# EAGLE design conv (EAGLE 9.6.2)
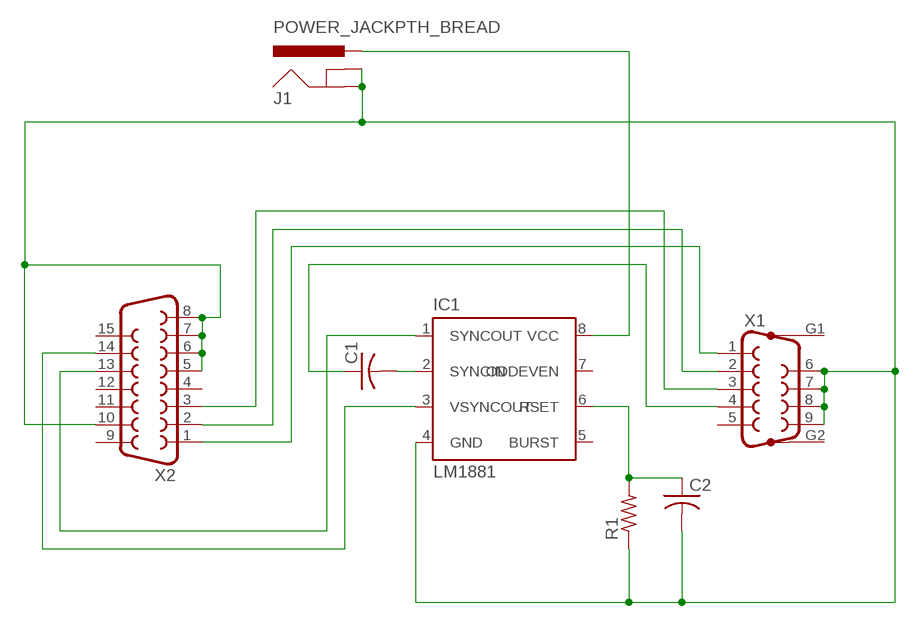
[diagram p0: schematic, sheet 1]

## Parts
C1  C-US025-040X050  [C025-040X050]
C2  C-US025-040X050  [C025-040X050]
IC1  LM1881  [DIL08]
J1  POWER_JACKPTH_BREAD  [POWER_JACK_PTH_BREAD]
R1  R-US_0207/10  [0207/10]
X1  F09HP  [F09HP]
X2  F15HDH  [HDF15H]

## Nets
GND: C2.2 IC1.4(GND) J1.GND J1.GNDBREAK R1.1 X1.6 X1.7 X1.8 X1.9 X2.5 X2.6 X2.7 X2.8 X2.10
N$1: X1.1 X2.1
N$2: X1.2 X2.2
N$3: X1.3 X2.3
N$4: C1.1 X1.4
N$5: C1.2 IC1.2(SYNCIN)
N$6: C2.1 IC1.6(RSET) R1.2
N$7: IC1.8(VCC) J1.PWR
N$8: IC1.1(SYNCOUT) X2.13
N$9: IC1.3(VSYNCOUT) X2.14
Unconnected: IC1.5(BURST) IC1.7(ODDEVEN) X1.5 X1.G1 X1.G2 X2.4 X2.9 X2.11 X2.12 X2.15

## Library data of the parts
C1 C2 = adafruit:C-US: CAPACITOR, American symbol
IC1 = lm1881:LM1881
J1 = SparkFun-Connectors:POWER_JACK: Power Jack Connector This is the standard 5.5mm barrel jack for power. The PTH is the most common, proven, reliable, footprint. The Slot footprint only works if the mill layer is transmitted to the PCB fab house so be warned. Here are the connectors we sell at SparkFun: DC Barrel Power Jack/Connector <https://www.sparkfun.com/products/119> (PRT-00119) DC Barrel Power Jack/Connector (SMD) <https://www.sparkfun.com/products/12748> (PRT-12748) DC Barrel Jack Adapter - Breadboard Compatible <https://www.sparkfun.com/products/10811> (PRT-10811) It is used on this SparkFun product (and many, many others): SparkFun RedBoard - Programmed with Arduino <https://www.sparkfun.com/products/12757> (DEV-12757) Also, if you need a mating power supply or connector, please check these out: Wall Adapter Power Supply - 9VDC 650mA <https://www.sparkfun.com/products/298> (TOL-00298) DC Barrel Jack Adapter - Male <https://www.sparkfun.com/products/10287> (PRT-10287); PROD_ID: PRT-10811
R1 = adafruit:R-US_: RESISTOR, American symbol
X1 = con-subd:F09HP: SUB-D; OC_FARNELL: unknown; OC_NEWARK: unknown
X2 = con-subd:F15: SUB-D; OC_FARNELL: unknown; OC_NEWARK: unknown

## Board
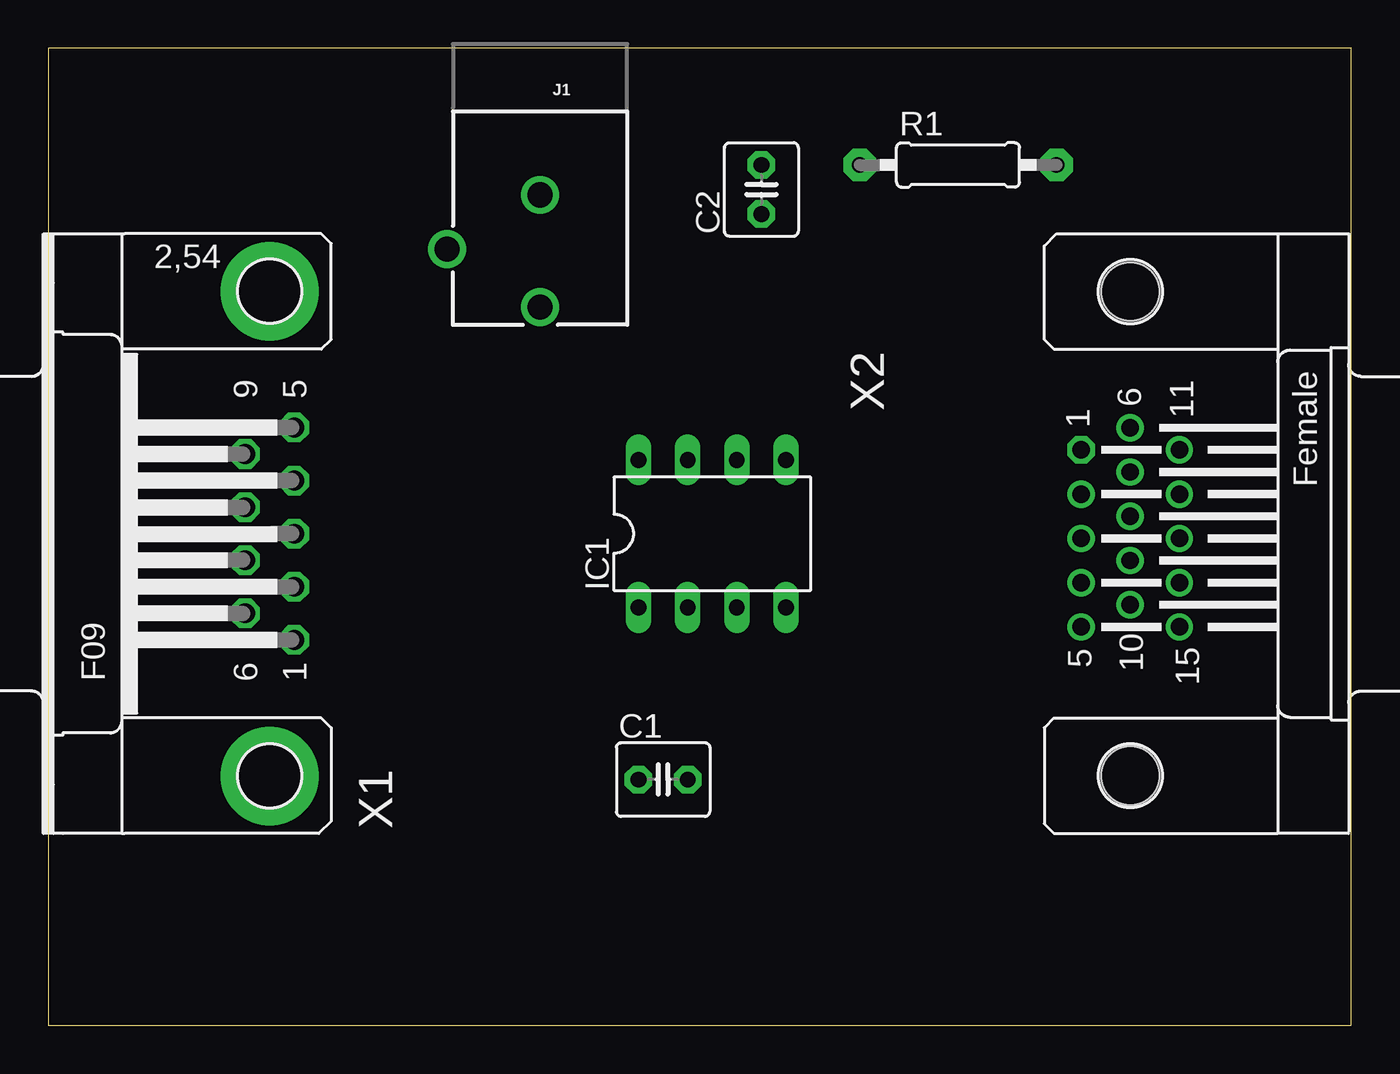
[diagram p1: board, top side]
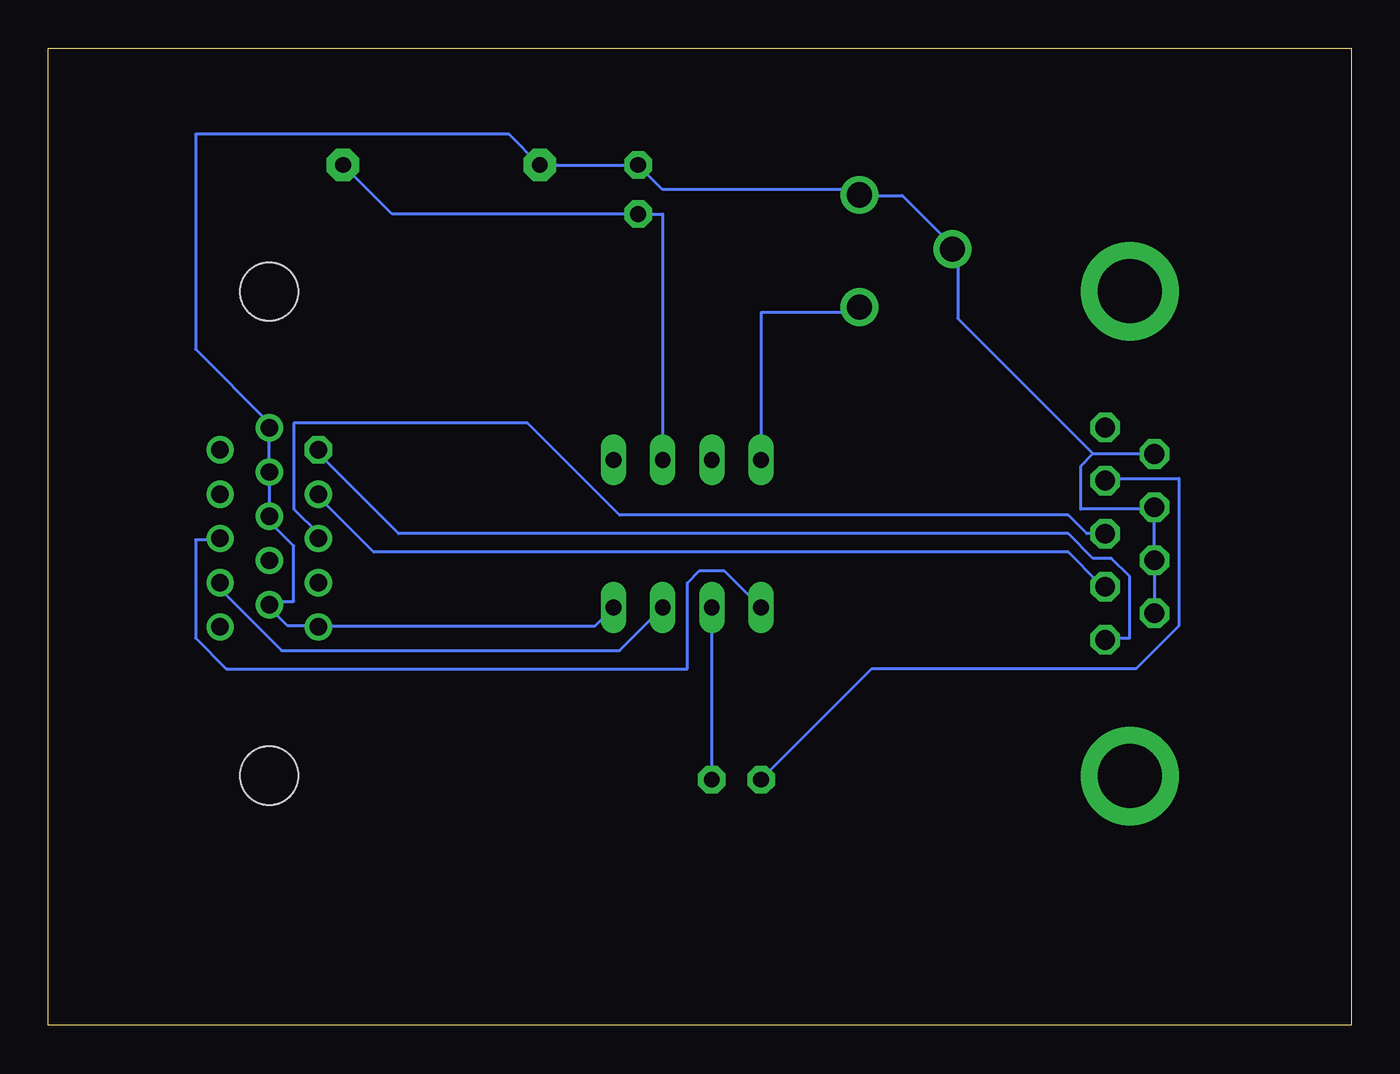
[diagram p2: board, bottom side, seen from below]

Size 67.29 x 50.47 mm. Coordinates in mm from the lower left corner, seen from the top.
Outline: 0,0 67.29,0 67.29,50.47 0,50.47 0,0
Copper layers (1*16): Top 0.035mm / dielectric 0.15mm / Bottom 0.035mm
Design rules "default *": minimum track width 6mil, minimum drill 0.35mm, track to track 20mil, track to pad 15mil, pad to pad 6mil, via to via 6mil, smd to smd 6mil, copper to edge 40mil, drill to drill 6mil, minimum pad ring 10mil, minimum via ring 8mil, stop-mask expansion 4mil, vias tented up to drill 0mil, thermal gap 10mil

### Footprints (pad centres in the part's own frame; a part is rotated, then mirrored left to right if it is on the bottom)
C025-040X050 = drill 0.813 pad 1.422 octagon: 1 -1.27,0; 2 1.27,0
DIL08 = drill 0.813 long: 1 -3.81,-3.81; 2 -1.27,-3.81; 3 1.27,-3.81; 4 3.81,-3.81; 5 3.81,3.81; 6 1.27,3.81; 7 -1.27,3.81; 8 -3.81,3.81
POWER_JACK_PTH_BREAD = drill 1.3: GND 0,7.9; GNDBREAK 4.8,10.7; PWR 0,13.7
0207/10 = drill 0.813 pad 1.676 octagon: 1 -5.08,0; 2 5.08,0
F09HP = drill 1.016 octagon: 1 -5.486,-1.27; 2 -2.743,-1.27; 3 0,-1.27; 4 2.743,-1.27; 5 5.486,-1.27; 6 -4.115,1.27; 7 -1.372,1.27; 8 1.372,1.27; 9 4.115,1.27 | drill 3.302 pad 5.08: G1 -12.522,0; G2 12.522,0
HDF15H = drill 0.9 octagon: 1 4.329,2.54 | drill 0.9: 2 2.043,2.54; 3 -0.243,2.54; 4 -2.529,2.54; 5 -4.815,2.54; 6 5.472,0; 7 3.186,0; 8 0.9,0; 9 -1.386,0; 10 -3.672,0; 11 4.329,-2.54; 12 2.043,-2.54; 13 -0.243,-2.54; 14 -2.529,-2.54; 15 -4.815,-2.54 | hole 3: -12.5,0; 12.5,0

### Placement (x,y rotation side)
C1  31.75,12.7 0 top
C2  36.83,43.18 90 top
IC1  34.29,25.4 0 top
J1  25.4,50.8 180 top
R1  46.99,44.45 0 top
X1  11.43,25.4 90 top
X2  55.88,25.4 90 top

### Tracks (layer width: path | path; a pad name or v marks a point on that pad's centre or on a via)
GND
  Bottom 0.152: IC1.4 39.05,20.64 53.34,20.64 | 53.34,20.64 54.93,20.64 55.88,21.59 X2.10 55.88,21.91 54.61,21.91 54.61,24.77 55.88,26.04 X2.8 X2.7 X2.6 55.88,31.12 59.69,34.93 59.69,46.04 43.5,46.04 R1.1 C2.2 35.56,43.18 25.4,43.18 J1.GND 25.4,42.86 23.18,42.86 20.64,40.32 J1.GNDBREAK 20.32,40.01 20.32,36.51 13.34,29.53 | 53.34,20.64 X2.5 | X1.6 X1.7 10.16,26.67 | 13.34,29.53 10.16,29.53 X1.9 | 13.34,29.53 13.97,28.89 13.97,26.67 10.16,26.67 | 10.16,26.67 X1.8
N$1
  Bottom 0.152: X2.1 53.34,29.53 49.21,25.4 14.61,25.4 13.34,24.13 12.38,24.13 11.43,23.18 11.43,20 12.7,20 X1.1
N$2
  Bottom 0.152: X2.2 53.34,27.3 50.48,24.45 14.61,24.45 13.02,22.86 12.7,22.86 X1.2
N$3
  Bottom 0.152: X1.3 13.65,25.4 14.61,26.35 37.78,26.35 42.55,31.12 54.61,31.12 54.61,26.67 53.34,25.4 X2.3
N$4
  Bottom 0.152: C1.1 24.77,18.41 11.11,18.41 8.89,20.64 8.89,28.26 12.7,28.26 X1.4
N$5
  Bottom 0.152: C1.2 IC1.2
N$6
  Bottom 0.152: IC1.6 35.56,41.91 C2.1 49.53,41.91 R1.2
N$7
  Bottom 0.152: IC1.8 30.48,36.83 25.4,36.83 J1.PWR
N$8
  Bottom 0.152: IC1.1 32.38,23.5 33.66,23.5 34.29,22.86 34.29,18.41 58.1,18.41 59.69,20 59.69,25.08 58.42,25.08 X2.13
N$9
  Bottom 0.152: IC1.3 37.78,19.37 55.24,19.37 58.42,22.54 X2.14